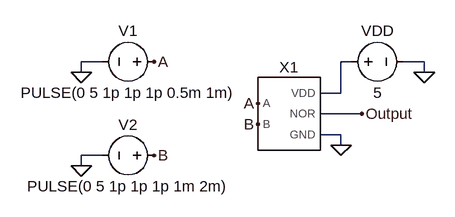
[diagram p0: schematic NOR_block.asc]
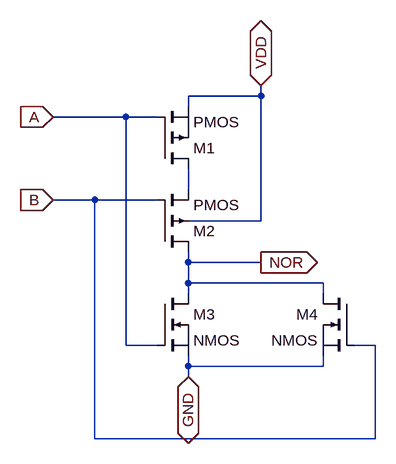
[diagram p1: sub-circuit nor.asc]
NOR_block.asc, the LTspice schematic file:
Version 4
SHEET 1 880 680
WIRE -80 80 -112 80
WIRE 304 80 288 80
WIRE 416 80 384 80
WIRE -112 96 -112 80
WIRE 416 96 416 80
WIRE 288 128 288 80
WIRE 288 128 256 128
WIRE 320 160 256 160
WIRE 288 192 256 192
WIRE 288 208 288 192
WIRE -80 224 -112 224
WIRE -112 240 -112 224
FLAG 288 208 0
FLAG 416 96 0
FLAG -112 96 0
FLAG -112 240 0
FLAG 320 160 Output
FLAG 0 80 A
FLAG 0 224 B
FLAG 160 176 B
FLAG 160 144 A
SYMBOL nor 208 160 R0
SYMATTR InstName X1
SYMBOL voltage 16 80 R90
WINDOW 0 -32 56 VBottom 2
WINDOW 3 32 56 VTop 2
WINDOW 123 0 0 Left 0
WINDOW 39 0 0 Left 0
SYMATTR InstName V1
SYMATTR Value PULSE(0 5 1p 1p 1p 0.5m 1m)
SYMBOL voltage 16 224 R90
WINDOW 0 -32 56 VBottom 2
WINDOW 3 32 56 VTop 2
WINDOW 123 0 0 Left 0
WINDOW 39 0 0 Left 0
SYMATTR InstName V2
SYMATTR Value PULSE(0 5 1p 1p 1p 1m 2m)
SYMBOL voltage 288 80 M90
WINDOW 0 -32 56 VBottom 2
WINDOW 3 32 56 VTop 2
WINDOW 123 0 0 Left 0
WINDOW 39 0 0 Left 0
SYMATTR InstName VDD
SYMATTR Value 5

nor.asc, the sub-circuit schematic file:
Version 4
SHEET 1 880 680
WIRE 336 32 336 16
WIRE 336 32 224 32
WIRE 224 48 224 32
WIRE 128 64 16 64
WIRE 176 64 128 64
WIRE 224 176 224 144
WIRE 80 192 16 192
WIRE 176 192 80 192
WIRE 336 224 336 32
WIRE 336 224 224 224
WIRE 224 288 224 272
WIRE 336 288 224 288
WIRE 224 320 224 288
WIRE 432 320 224 320
WIRE 224 336 224 320
WIRE 432 336 432 320
WIRE 128 416 128 64
WIRE 176 416 128 416
WIRE 512 416 480 416
WIRE 224 448 224 432
WIRE 432 448 432 432
WIRE 432 448 224 448
WIRE 224 464 224 448
WIRE 80 560 80 192
WIRE 512 560 512 416
WIRE 512 560 80 560
FLAG 16 64 A
IOPIN 16 64 In
FLAG 16 192 B
IOPIN 16 192 In
FLAG 336 16 VDD
IOPIN 336 16 BiDir
FLAG 224 464 GND
IOPIN 224 464 BiDir
FLAG 336 288 NOR
IOPIN 336 288 Out
SYMBOL pmos 176 144 M180
SYMATTR InstName M1
SYMBOL nmos 176 336 R0
SYMATTR InstName M3
SYMBOL nmos 480 336 M0
SYMATTR InstName M4
SYMBOL pmos4 176 272 M180
SYMATTR InstName M2

The netlist it stands for:
* NOR_block.asc
XX1 A B 0 Output N001 nor
V1 A 0 PULSE(0 5 1p 1p 1p 0.5m 1m)
V2 B 0 PULSE(0 5 1p 1p 1p 1m 2m)
VDD N001 0 5

* block symbol definitions
.subckt nor A B GND NOR VDD
M1 N001 A VDD VDD PMOS
M3 NOR A GND GND NMOS
M4 NOR B GND GND NMOS
M2 NOR B N001 VDD PMOS
.ends nor

.model NMOS NMOS
.model PMOS PMOS
.lib standard.mos
.backanno
.end